# Altium schematic sheet CM4_HDMI.SchDoc
size A4; SheetNumber: 2; SheetTotal: 12
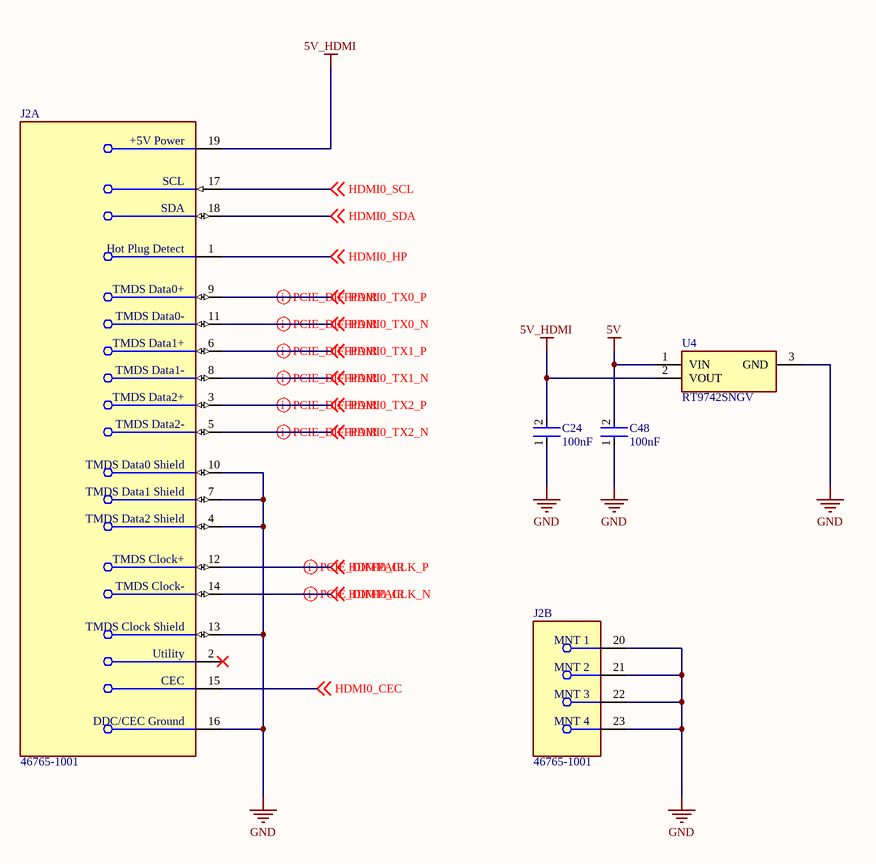
[diagram p0: CM4_HDMI.SchDoc]

## Parts
C24  100nF  [FP-GRM15-MFG]
C48  100nF  [FP-GRM15-MFG]
J2  46765-1001  [FP-46765-1001-MFG]  (parts A,B of 2)
U4  RT9742SNGV  [SOT95P279X130-3N]

## Nets
5V: C48.2 U4.1(VIN)
5V_HDMI: C24.2 J2.19(+5V_Power) U4.2(VOUT)
GND: C24.1 C48.1 J2.4(TMDS_Data2_Shield) J2.7(TMDS_Data1_Shield) J2.10(TMDS_Data0_Shield) J2.13(TMDS_Clock_Shield) J2.16(DDC/CEC_Ground) J2.20(MNT_1) J2.21(MNT_2) J2.22(MNT_3) J2.23(MNT_4) U4.3(GND)
HDMI0_CEC: J2.15(CEC) ; off-sheet HDMI0_CEC
HDMI0_CLK_N: J2.14(TMDS_Clock-) ; off-sheet HDMI0_CLK_N
HDMI0_CLK_P: J2.12(TMDS_Clock+) ; off-sheet HDMI0_CLK_P
HDMI0_HP: J2.1(Hot_Plug_Detect) ; off-sheet HDMI0_HP
HDMI0_SCL: J2.17(SCL) ; off-sheet HDMI0_SCL
HDMI0_SDA: J2.18(SDA) ; off-sheet HDMI0_SDA
HDMI0_TX0_N: J2.11(TMDS_Data0-) ; off-sheet HDMI0_TX0_N
HDMI0_TX0_P: J2.9(TMDS_Data0+) ; off-sheet HDMI0_TX0_P
HDMI0_TX1_N: J2.8(TMDS_Data1-) ; off-sheet HDMI0_TX1_N
HDMI0_TX1_P: J2.6(TMDS_Data1+) ; off-sheet HDMI0_TX1_P
HDMI0_TX2_N: J2.5(TMDS_Data2-) ; off-sheet HDMI0_TX2_N
HDMI0_TX2_P: J2.3(TMDS_Data2+) ; off-sheet HDMI0_TX2_P

Not connected (* = marked no-connect by the designer): J2 2(Utility)*

## Layout directives
differential pair; differential pair class HDMI: HDMI0_CLK_N, HDMI0_CLK_P, HDMI0_TX0_N, HDMI0_TX0_P, HDMI0_TX1_N, HDMI0_TX1_P, HDMI0_TX2_N, HDMI0_TX2_P

## Library data of the parts
C24 C48 = CMP-2100-03641-2: CAP CER 0.1UF 16V X7R 0402; Manufacturer Part Number: GRM155R71C104KA88D; Manufacturer: Murata; Standoff Height: 0mm; Tolerance: 10%; Voltage Rating: 16Vdc; Material: Ceramic; Capacitance: 0.10μF; Value: 0.10μF; RoHS: TRUE; Temperature Characteristic: X7R; Octopart: https://octopart.com/grm155r71c104ka88d-murata-196880; Digikey Description: CAP CER 0.1UF 16V X7R 0402; Device Class L3: Ceramic Capacitors; Height: 0.55mm; ComponentLink2Description: Datasheet; Temperature Range Low: -55°C; Ipc Land Pattern Name: CAPC10050X219; ComponentLink2URL: https://search.murata.co.jp/Ceramy/image/img/A01X/G101/ENG/GRM155R71H471KA01-01A.pdf; Device Class L1: Passive Components; Lead Free: yes; Category: Cap; Package: GRM15; Temperature: -55°C to +125°C; Device Class L2: Capacitors; Temperature Range High: +125°C; Mouser Description: 0402 0.1 uF 16V ±10 % Tolerance X7R SMT Multilayer Ceramic Capacitor
J2 = CMP-04768-000007-1: CONN RCP MICRO HDMI 19POS SMD RA; Voltage Rating: 30V; Pitch: 0.4mm; Number of Terminals/Pins: 19; Number of Ports: 1; Current Rating: 800mA; Gender: Receptacle; Body Material: Plastic; Min Operating Temperature: -30°C; Series: 46765; Contact Material: Copper Alloy; Contact Plating: Gold; Connector Type: HDMI; Mount: Surface Mount; Termination: Solder; Package Quantity: 1000; Flammability Rating: UL94 V-0; Packaging: Tape and Reel; Length: 6.5mm; Number of Positions: 19; Number of Contacts: 19; Weight: 0.0109oz; Max Current Rating: 800mA; Case/Package: Metal; Housing Material: Polymer; RoHS Compliant: Yes; Max Operating Temperature: 85°C; Orientation: Right Angle; Depth: 7.5mm; Width: 7mm
U4 = RT9742SNGV: Integrated Circuit; Manufacturer_Name: RICHTEK; Datasheet Link: https://datasheet.lcsc.com/szlcsc/Richtek-Tech-RT9742ANGJ5F_C147955.pdf; Height: 1.295mm; Manufacturer_Part_Number: RT9742SNGV